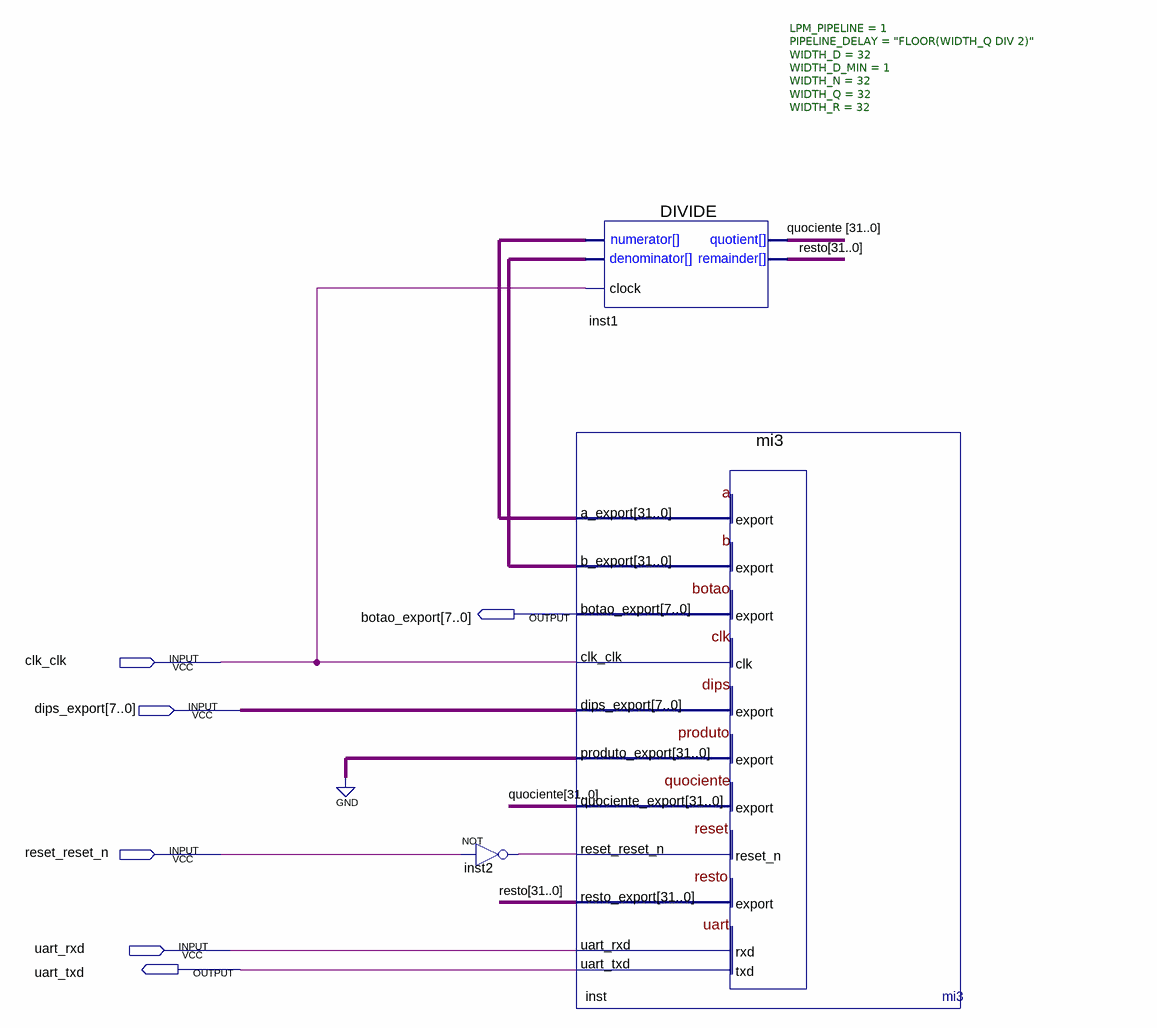
[diagram p0: schematic sheet]
// Quartus schematic mi.bdf as structural Verilog: 3 symbols, 6 pins
module mi (
  input  clk_clk,
  input  [7:0] dips_export,
  input  reset_reset_n,
  input  uart_rxd,
  output [7:0] botao_export,
  output uart_txd
);

  wire inst2_out;
  wire [31:0] inst_a_export, inst_b_export, quociente, resto;

  not inst2 (inst2_out, reset_reset_n);
  DIVIDE #(.LPM_PIPELINE(1), .PIPELINE_DELAY("FLOOR(WIDTH_Q DIV 2)"), .WIDTH_D(32), .WIDTH_D_MIN(1), .WIDTH_N(32), .WIDTH_Q(32), .WIDTH_R(32)) inst1 (
    .clock(clk_clk), .numerator(inst_a_export), .denominator(inst_b_export), .quotient(quociente),
    .remainder(resto));
  mi3 inst (
    .clk_clk(clk_clk), .dips_export(dips_export), .produto_export({32{1'b0}}), .quociente_export(quociente),
    .reset_reset_n(inst2_out), .resto_export(resto), .uart_rxd(uart_rxd), .a_export(inst_a_export),
    .b_export(inst_b_export), .botao_export(botao_export), .uart_txd(uart_txd));
endmodule
